# EAGLE design xbee-adapter (EAGLE 6.3)
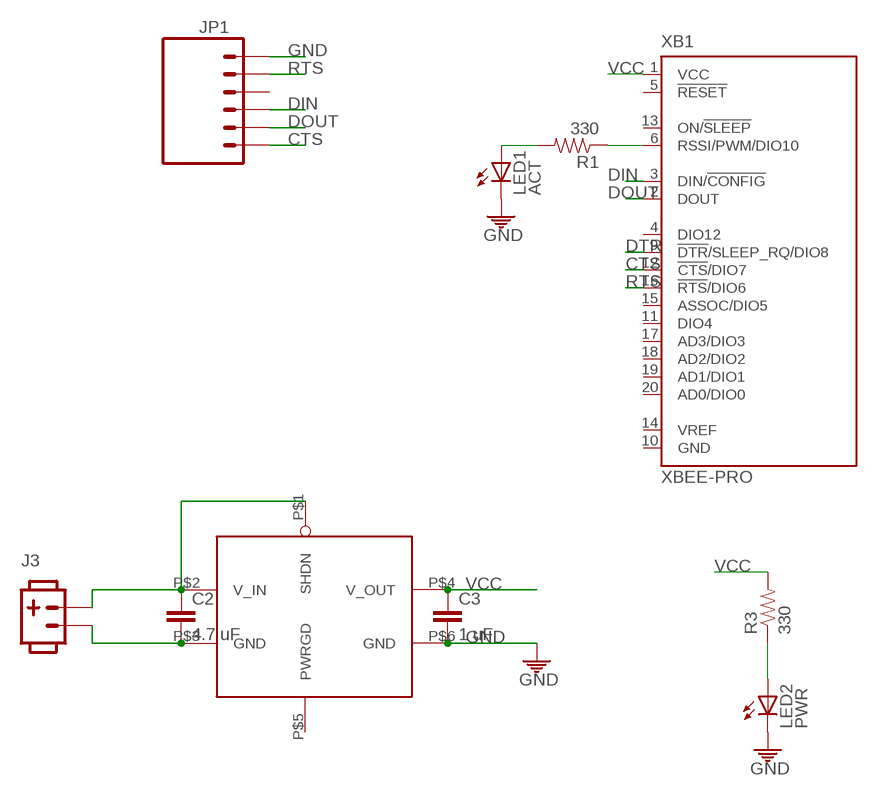
[diagram p0: schematic, sheet 1]

## Parts
C2  4.7 uF  CAP1206  [1206]
C3  1 uF  CAP1206  [1206]
J3  POW_CONNECTMALE  [SOCKET-MALE-3.96MM-2]
JP1  M06LOCK  [1X06_LOCK]
LED1  ACT  LED5MM  [LED5MM]
LED2  PWR  LED5MM  [LED5MM]
R1  330  RESISTOR0805-RES  [0805]
R3  330  RESISTOR0805-RES  [0805]
U$1  MCP1826  [SOT223-5]
XB1  XBEE-PRO  [XBEE-PRO]

## Nets
CTS: JP1.6 XB1.12(!CTS!/DIO7)
DIN: JP1.4 XB1.3(DIN/!CONFIG)
DOUT: JP1.5 XB1.2(DOUT)
DTR: XB1.9(!DTR!/SLEEP_RQ/DIO8)
GND [power]: C2.2 C3.2 J3.P$2 JP1.1 LED1.K(C) LED2.K(C) U$1.P$3(GND) U$1.P$6(GND)
N$1: LED2.A R3.1
N$2: R1.1 XB1.6(RSSI/PWM/DIO10)
N$4: LED1.A R1.2
RTS: JP1.2 XB1.16(!RTS!/DIO6)
VCC [power]: C3.1 R3.2 U$1.P$4(V_OUT) XB1.1(VCC)
VIN [power]: C2.1 J3.P$1 U$1.P$1(SHDN) U$1.P$2(V_IN)
Unconnected: JP1.3 U$1.P$5(PWRGD) XB1.4(DIO12) XB1.5(!RESET) XB1.11(DIO4) XB1.13(ON/!SLEEP) XB1.14(VREF) XB1.15(ASSOC/DIO5) XB1.17(AD3/DIO3) XB1.18(AD2/DIO2) XB1.19(AD1/DIO1) XB1.20(AD0/DIO0)

## Power pins joined to a net without a drawn wire
GND: XB1.10(GND)

## Library data of the parts
C2 C3 = ASL:CAP: Capacitor Standard 0603 ceramic capacitor, and 0.1" leaded capacitor.
J3 = ASL:POW_CONNECT
JP1 = ASL:M06: Header 6 Standard 6-pin 0.1" header. Use with straight break away headers (SKU : PRT-00116), right angle break away headers (PRT-00553), swiss pins (PRT-00743), machine pins (PRT-00117), and female headers (PRT-00115). Molex polarized connector foot print use with SKU : PRT-08094 with associated crimp pins and housings. NOTES ON THE VARIANTS LOCK and LOCK_LONGPADS... This footprint was designed to help hold the alignment of a through-hole component (i.e. 6-pin header) while soldering it into place. You may notice that each hole has been shifted either up or down by 0.005 of an inch from it's more standard position (which is a perfectly straight line). This slight alteration caused the pins (the squares in the middle) to touch the edges of the holes. Because they are alternating, it causes a "brace" to hold the component in place. 0.005 has proven to be the perfect amount of "off-center" position when using our standard breakaway headers. Although looks a little odd when you look at the bare footprint, once you have a header in there, the alteration is very hard to notice. Also, if you push a header all the way into place, it is covered up entirely on the bottom side. This idea of altering the position of holes to aid alignment will be further integrated into the Sparkfun Library for other footprints. It can help hold any component with 3 or more connection pins.
LED1 LED2 = ASL:LED: LEDs Standard schematic elements and footprints for 5mm, 3mm, 1206, and 0603 sized LEDs. 5mm - Spark Fun Electronics SKU : COM-00529 (and others)
R1 R3 = ASL:RESISTOR: Resistor Basic schematic elements and footprints for 0603, 1206, and PTH resistors.
U$1 = ASL:MCP1826
XB1 = xbee:XBEE: XBee (TM) /XBee-PRO(TM) OEM RF Modules Source: MaxStream, Inc. xbee_productmanual.pdf; MPN: XBP24-AWI-001; OC_FARNELL: 1337916; OC_NEWARK: 42M2667

## Net classes
1 power: width 0.762 mm, clearance 0.381 mm

## Board
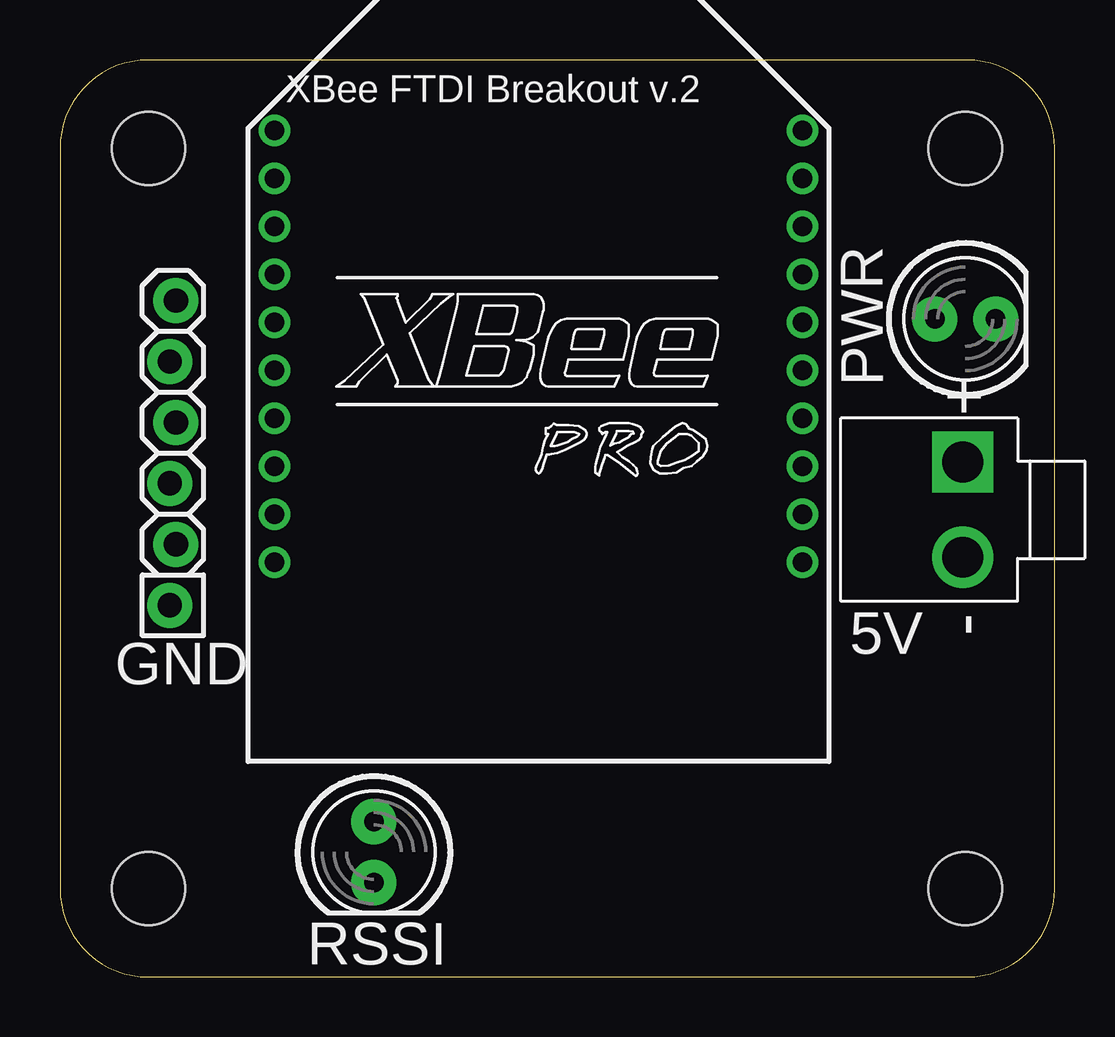
[diagram p1: board, top side]
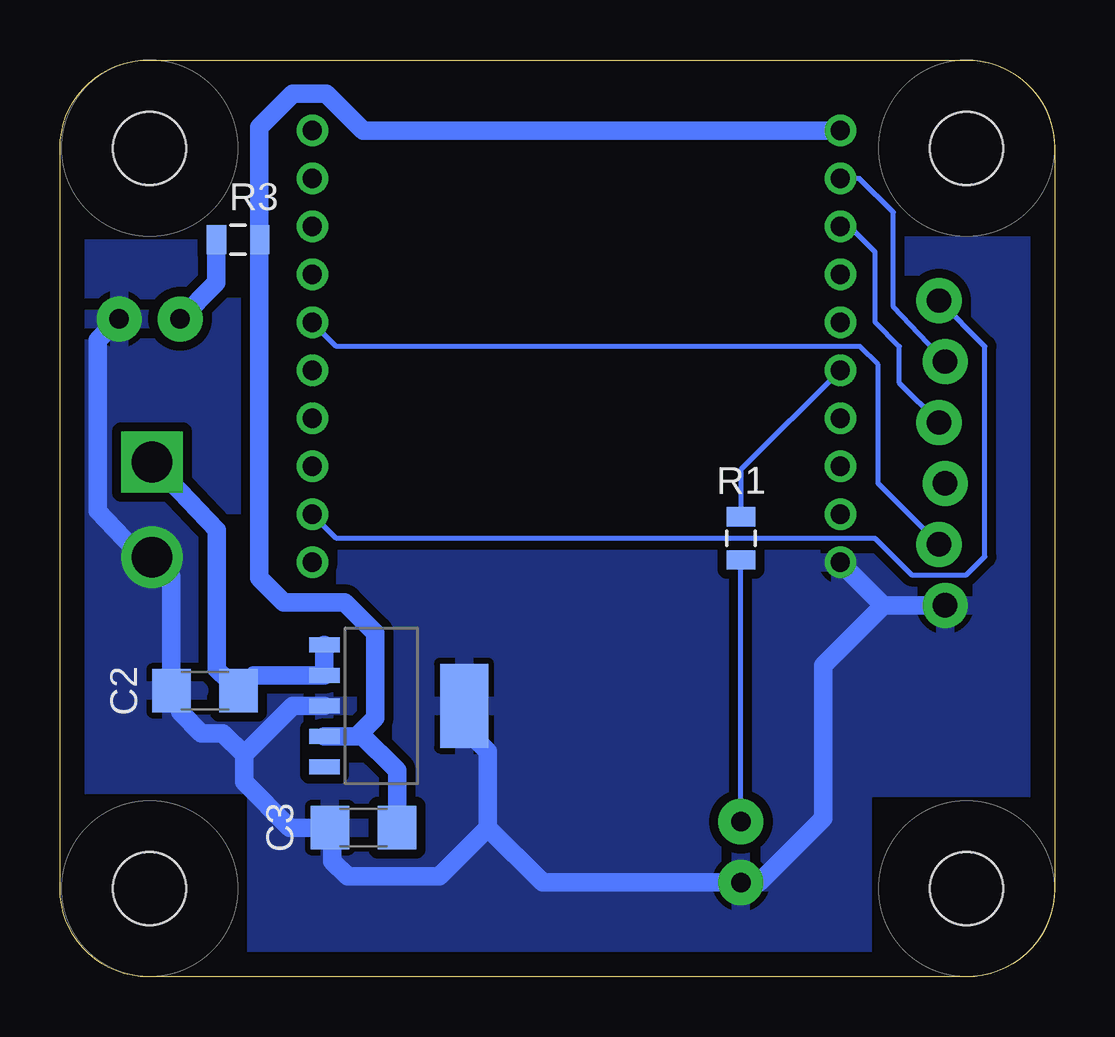
[diagram p2: board, bottom side, seen from below]

Size 41.45 x 38.23 mm. Coordinates in mm from the lower left corner, seen from the top.
Outline: 37.77,38.23 3.68,38.23 arc90 0,34.54 0,3.68 arc90 3.68,0 37.77,0 arc90 41.45,3.68 41.45,34.54 arc90 37.77,38.23
Copper layers (1*16): Top 0.035mm / dielectric 1.5mm / Bottom 0.035mm
Design rules "default *": minimum track width 8mil, minimum drill 24mil, track to track 8mil, track to pad 8mil, pad to pad 8mil, via to via 8mil, smd to smd 8mil, copper to edge 40mil, drill to drill 8mil, minimum pad ring 10mil, minimum via ring 8mil, stop-mask expansion 4mil, vias tented up to drill 0mil, thermal gap 10mil

### Footprints (pad centres in the part's own frame; a part is rotated, then mirrored left to right if it is on the bottom)
1206 = smd 1.6 x 1.8: 1 -1.4,0; 2 1.4,0
STAND-OFF-TIGHT = hole 3.048: 0,0
SOCKET-MALE-3.96MM-2 = drill 1.7 square: P$1 -1.98,0 | drill 1.7: P$2 1.98,0
1X06_LOCK = drill 1.016 pad 1.88: 1 0,0.127; 2 2.54,-0.127; 3 5.08,0.127; 4 7.62,-0.127; 5 10.16,0.127; 6 12.7,-0.127
LED5MM = drill 0.813 pad 1.88: A -1.27,0; K 1.27,0
0805 = smd 0.8 x 1.2: 1 -0.9,0; 2 0.9,0
SOT223-5 = smd 0.635 x 1.27: P$1 -2.54,-2.625; P$2 -1.27,-2.625; P$3 0,-2.625; P$4 1.27,-2.625; P$5 2.54,-2.625 | smd 3.5 x 2: P$6 0,3.2
XBEE-PRO = drill 0.8 pad 1.27: 1 -11,9; 2 -11,7; 3 -11,5; 4 -11,3; 5 -11,1; 6 -11,-1; 7 -11,-3; 8 -11,-5; 9 -11,-7; 10 -11,-9; 11 11,-9; 12 11,-7; 13 11,-5; 14 11,-3; 15 11,-1; 16 11,1; 17 11,3; 18 11,5; 19 11,7; 20 11,9

### Placement (x,y rotation side)
C2  35.41,11.94 180 bottom
C3  28.8,6.22 180 bottom
E$1  [STAND-OFF-TIGHT]  3.68,34.54 0 top
E$2  [STAND-OFF-TIGHT]  3.68,3.68 0 top
E$3  [STAND-OFF-TIGHT]  37.72,3.68 0 top
E$4  [STAND-OFF-TIGHT]  37.72,34.54 0 top
J3  37.62,19.48 270 top
JP1  4.7,15.49 90 top
LED1  13.08,5.21 270 top
LED2  37.72,27.43 0 top
R1  13.08,18.29 270 bottom
R3  34.04,30.73 0 bottom
U$1  27.81,11.3 270 bottom
XB1  19.94,26.29 0 top

### Tracks (layer width: path | path; a pad name or v marks a point on that pad's centre or on a via)
CTS
  Bottom 0.203: JP1.6 2.92,26.29 2.92,17.53 3.68,16.76 5.97,16.76 7.49,18.29 29.94,18.29 XB1.12
DIN
  Bottom 0.203: XB1.3 8.56,31.29 7.49,30.23 7.49,27.3 6.48,26.29 6.48,24.77 JP1.4
DOUT
  Bottom 0.203: JP1.5 6.73,27.94 6.73,31.88 8.14,33.29 XB1.2
GND
  Bottom 0.762: U$1.P$6 24.64,11.28 24.64,10.41 23.62,9.4 23.62,6.22 | U$1.P$3 31.75,11.3 33.78,9.27 | LED2.K 39.88,26.54 39.88,19.43 38.08,17.5 J3.P$2 36.81,16.69 C2.2 36.45,11.58 36.45,11.05 35.56,10.16 34.67,10.16 33.78,9.27 | JP1.1 7.14,15.49 | 7.14,15.49 XB1.10 | 7.14,15.49 9.65,12.99 9.65,6.6 12.32,3.94 LED1.K 21.34,3.94 23.62,6.22 | 33.78,9.27 33.78,8.13 31.88,6.22 C3.2 30.1,6.12 30.1,4.83 29.46,4.19 25.65,4.19 23.62,6.22
  pour Bottom: 0.64,7.87 8,7.87 8,0.51 33.27,0.51 33.27,8 40.51,8 40.51,30.35 33.27,30.35 33.27,37.47 7.87,37.47 7.87,30.48 0.64,30.48
N$1
  Bottom 0.762: R3.1 34.94,28.95 LED2.A
N$2
  Bottom 0.203: XB1.6 13.08,21.15 R1.1
N$4
  Bottom 0.203: LED1.A R1.2
RTS
  Bottom 0.203: JP1.2 7.37,20.57 7.37,25.53 8.13,26.29 29.94,26.29 XB1.16
VCC
  Bottom 0.762: 28.96,10.16 28.32,10.79 28.32,14.35 29.59,15.62 32.13,15.62 33.15,16.64 33.15,30.86 | 28.96,10.16 29.08,10.03 U$1.P$4 | XB1.1 28.81,35.29 30.35,36.83 31.75,36.83 33.15,35.43 33.15,30.86 | R3.2 33.14,30.85 33.15,30.86 | C3.1 27.4,8.61 28.96,10.16
VIN
  Bottom 0.762: U$1.P$1 U$1.P$2 33.37,12.57 C2.1 34.92,12.83 34.92,18.64 J3.P$1

### Text on the board
tPlace: PWR | 5V | GND | RSSI
tNames: XBee FTDI Breakout v.2